# EAGLE design 555_devnight (EAGLE 7.3.0)
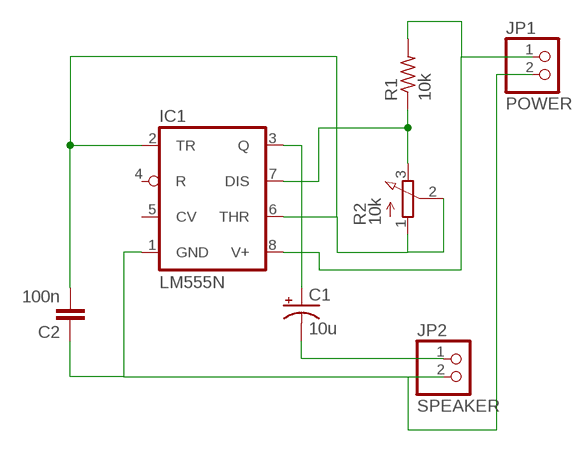
[diagram p0: schematic, sheet 1]

## Parts
C1  10u  CPOL-USE3.5-8  [E3,5-8]
C2  100n  C-EU050-025X075  [C050-025X075]
IC1  LM555N  [DIL08-ROUND]
JP1  POWER  PINHD-1X2  [1X02]
JP2  SPEAKER  PINHD-1X2  [1X02]
R1  10k  R-US_0207/10  [0207/10]
R2  10k  3RP/1610N  [3RP/1610N]

## Nets
N$1: IC1.8(V+) JP1.1 R1.2
N$2: IC1.7(DIS) R1.1 R2.3(E)
N$3: C1.+ IC1.3(Q)
N$4: C1.- JP2.1
N$5: C2.1 IC1.1(GND) JP1.2 JP2.2
N$6: C2.2 IC1.2(TR) IC1.6(THR) R2.1(A) R2.2(S)
Unconnected: IC1.4(R) IC1.5(CV)

## Library data of the parts
C1 = rcl:CPOL-US: POLARIZED CAPACITOR, American symbol
C2 = rcl:C-EU: CAPACITOR, European symbol
IC1 = adafruit:*555: TIMER Changed DIP package to have round (not oval) pin pads http://www.ladyada.net/library/pcb/eaglelibrary.html
JP1 JP2 = pinhead:PINHD-1X2: PIN HEADER
R1 = rcl:R-US_: RESISTOR, American symbol
R2 = pot:3RP/1610N: 16mm Potentiometer one level Source: http://www.alphapotentiometers.net/html/16mm_pot_2.html

## Board
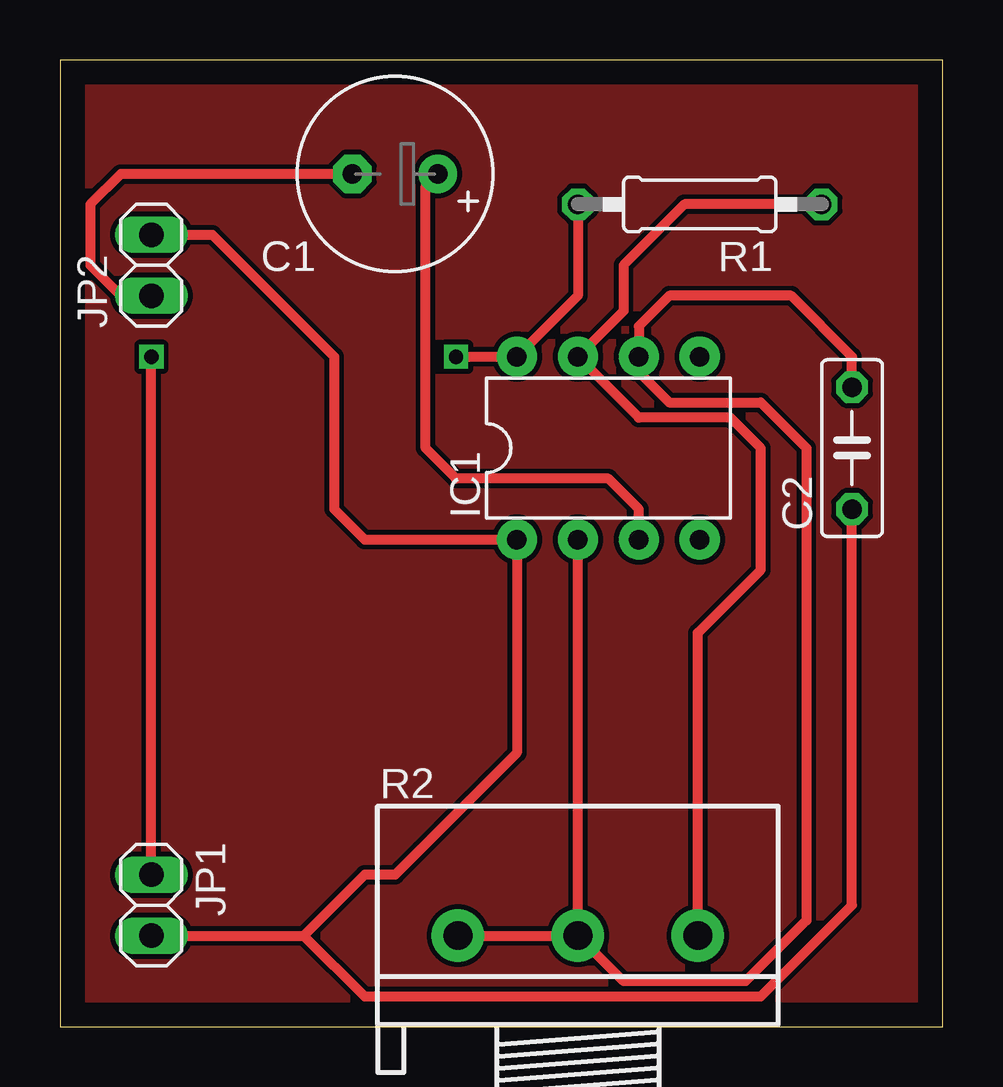
[diagram p1: board, top side]
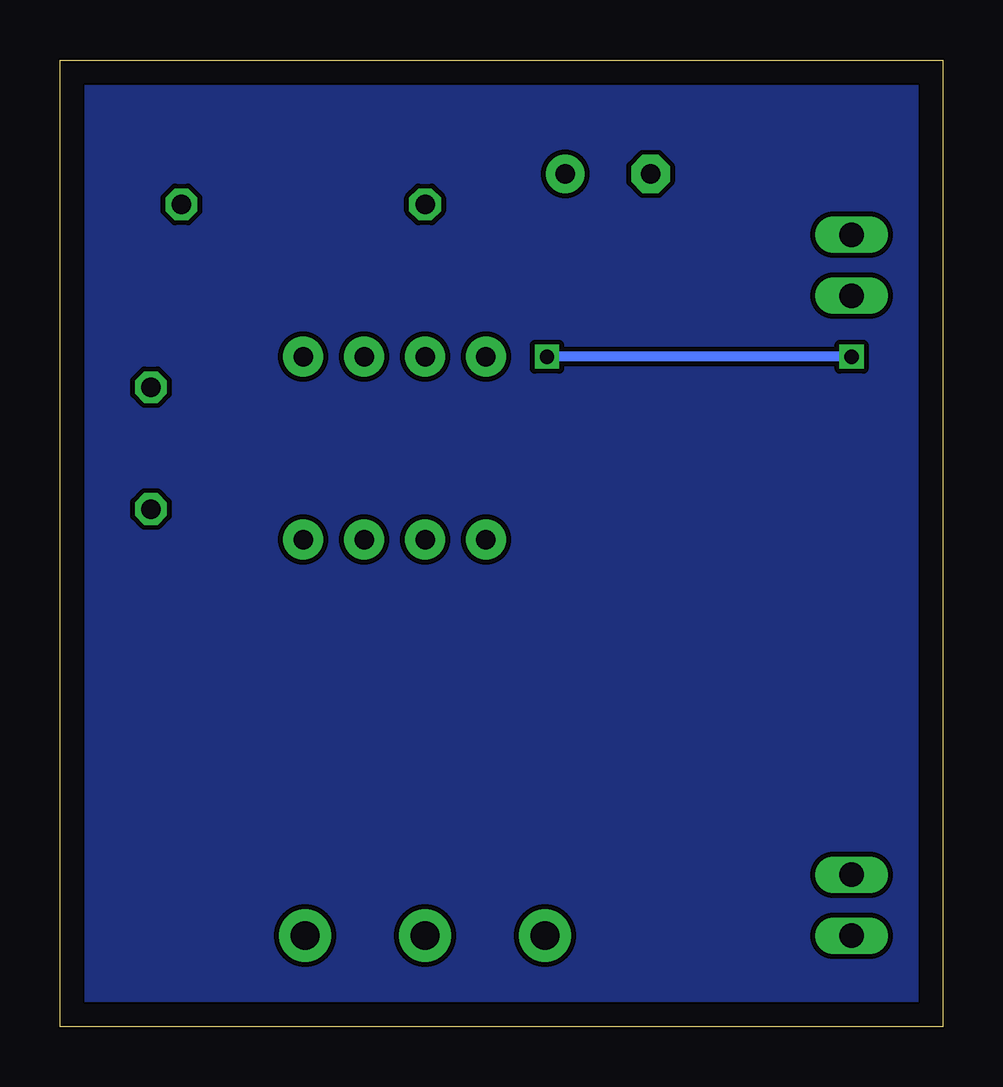
[diagram p2: board, bottom side, seen from below]

Size 36.81 x 40.31 mm. Coordinates in mm from the lower left corner, seen from the top.
Outline: 0,0 36.81,0 36.81,40.31 0,40.31 0,0
Copper layers (1*16): Top 0.035mm / dielectric 1.5mm / Bottom 0.035mm
Design rules "default": minimum track width 10mil, minimum drill 24mil, track to track 8mil, track to pad 8mil, pad to pad 8mil, via to via 8mil, smd to smd 8mil, copper to edge 40mil, drill to drill 8mil, minimum pad ring 10mil, minimum via ring 8mil, stop-mask expansion 4mil, vias tented up to drill 0mil, thermal gap 10mil

### Footprints (pad centres in the part's own frame; a part is rotated, then mirrored left to right if it is on the bottom)
E3,5-8 = drill 0.813 pad 1.6: + -1.778,0 | drill 0.813 pad 1.6 octagon: - 1.778,0
C050-025X075 = drill 0.813 octagon: 1 -2.54,0; 2 2.54,0
DIL08-ROUND = drill 0.813 pad 1.676: 1 -3.81,-3.81; 2 -1.27,-3.81; 3 1.27,-3.81; 4 3.81,-3.81; 5 3.81,3.81; 6 1.27,3.81; 7 -1.27,3.81; 8 -3.81,3.81
1X02 = drill 1.016 long: 1 -1.27,0; 2 1.27,0
0207/10 = drill 0.813 octagon: 1 -5.08,0; 2 5.08,0
3RP/1610N = drill 1.2 pad 2.184: 1 -5,0; 2 0,0; 3 5,0

### Placement (x,y rotation side)
C1  13.97,35.56 180 top
C2  33.02,24.13 90 top
IC1  22.86,24.13 0 top
JP1  3.81,5.08 270 top
JP2  3.81,31.75 90 top
R1  26.67,34.29 180 top
R2  21.59,3.81 0 top

### Tracks (layer width: path | path; a pad name or v marks a point on that pad's centre or on a via)
N$1  (via drill 0.6)
  Top 0.406: R1.2 21.59,30.48 IC1.8 v16.51,27.94 | JP1.1 v3.81,27.94
  Bottom 0.406: v3.81,27.94 v16.51,27.94
N$2
  Top 0.406: R2.3 26.59,16.43 29.21,19.05 29.21,24.13 27.94,25.4 24.13,25.4 IC1.7 23.5,29.84 23.5,31.75 26.04,34.29 R1.1
N$3
  Top 0.406: IC1.3 24.13,21.59 22.86,22.86 16.51,22.86 15.24,24.13 15.24,35.05 C1.+
N$4
  Top 0.406: C1.- 2.54,35.56 1.27,34.29 1.27,31.75 2.54,30.48 JP2.1
N$5
  Top 0.406: JP1.2 10.16,3.81 | 10.16,3.81 12.7,1.27 29.21,1.27 33.02,5.08 C2.1 | 10.16,3.81 12.7,6.35 13.97,6.35 19.05,11.43 IC1.1 12.7,20.32 11.43,21.59 11.43,27.94 6.35,33.02 JP2.2
N$6
  Top 0.406: R2.1 R2.2 | R2.2 IC1.2 | C2.2 33.02,27.94 30.48,30.48 25.4,30.48 24.13,29.21 IC1.6 24.13,27.3 25.4,26.04 29.21,26.04 31.11,24.13 31.11,4.45 28.57,1.91 23.5,1.91 R2.2
N$7
  pour Top: 0,40.64 0,0 36.83,0 36.83,40.64
N$8
  pour Bottom: 0,40.64 0,0 36.83,0 36.83,40.64